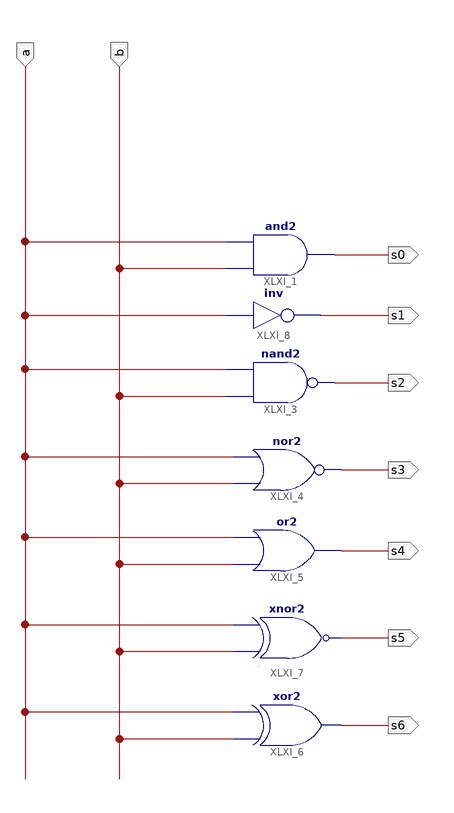
[diagram p0: schematic sheet 1]
// Xilinx ISE schematic firstsch.sch (spartan3e) as structural Verilog: 7 symbols, 9 ports
module firstsch (
  input  a,
  input  b,
  output s0,
  output s1,
  output s2,
  output s3,
  output s4,
  output s5,
  output s6
);

  and XLXI_1 (s0, b, a);
  nand XLXI_3 (s2, b, a);
  nor XLXI_4 (s3, b, a);
  or XLXI_5 (s4, b, a);
  xor XLXI_6 (s6, b, a);
  xnor XLXI_7 (s5, b, a);
  not XLXI_8 (s1, a);
endmodule
